# EasyEDA Pro project shankPCB.epro

# Schematic Schematic1
Board Name: Board1; Create Date: 2026-04-15; Page Name: P1; Project Name: Shank_IMU; Schematic Name: Schematic1; Update Date: 2026-04-15; Company: 嘉立创EDA; Page Size: A4; Version: V1.0
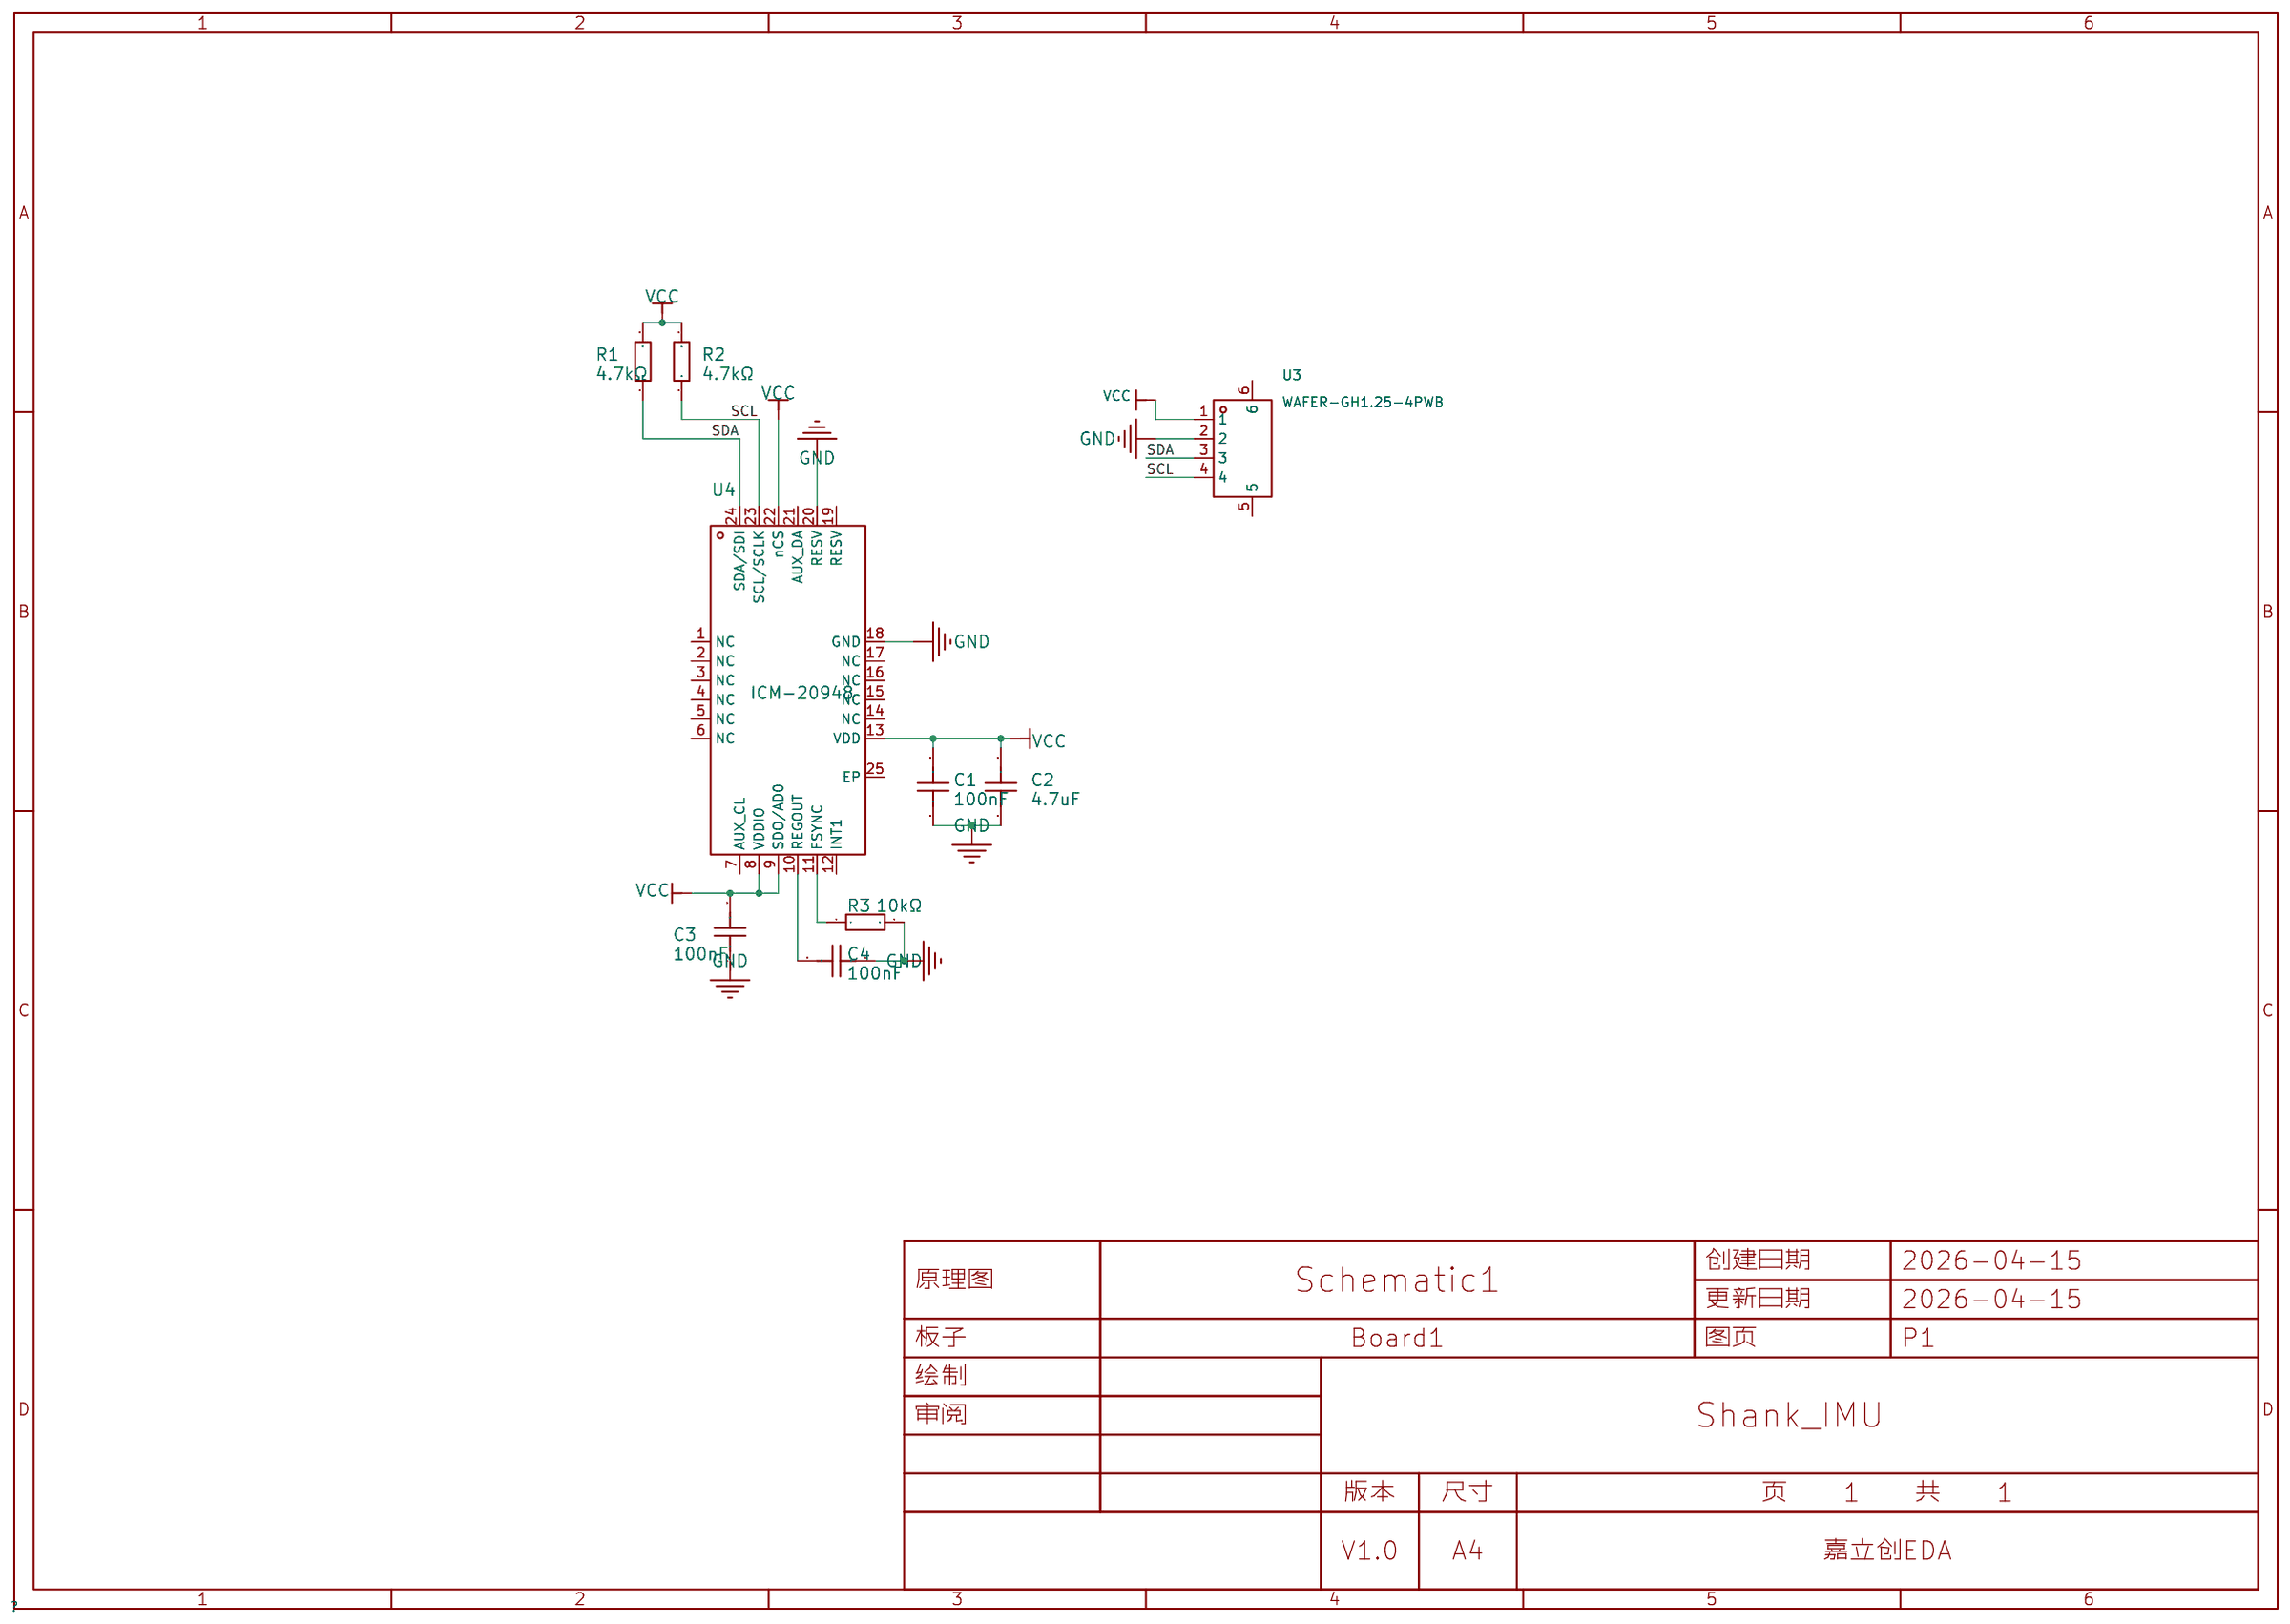
[diagram p0: schematic sheet]

## Parts
C1  100nF  [C0402]
C2  4.7uF  [C0402]
C3  100nF  [C0402]
C4  100nF  [C0402]
R1  4.7kΩ  [R0402]
R2  4.7kΩ  [R0402]
R3  10kΩ  [R0402]
U3  WAFER-GH1.25-4PWB  [CONN-SMD_4P-P1.25_XUNPU_WAFER-GH1.25-4PWB]
U4  ICM-20948  [QFN-24_L3.0-W3.0-P0.40-BL-EP]

## Library data of the parts
C1 C3 C4 = CL05B104KO5NNNC: 容值:100nF;精度:±10%;额定电压:16V;温度系数:X7R;; LCSC Part Name: 100nF ±10% 16V; Supplier Part: C1525; Manufacturer: SAMSUNG(三星); Supplier Footprint: 0402; JLCPCB Part Class: Basic Part; Datasheet: https://item.szlcsc.com/datasheet/CL05B104KO5NNNC/1877.html; Supplier: LCSC; Tolerance: ±10%; Voltage Rating: 16V; Temperature Coefficient: X7R
C2 = CL05A475MP5NRNC: 容值:4.7uF;精度:±20%;额定电压:10V;温度系数:X5R;; LCSC Part Name: 4.7uF ±20% 10V; Supplier Part: C23733; Manufacturer: SAMSUNG(三星); Supplier Footprint: 0402; JLCPCB Part Class: Basic Part; Datasheet: https://item.szlcsc.com/datasheet/CL05A475MP5NRNC/24469.html; Supplier: LCSC; Tolerance: ±20%; Voltage Rating: 10V; Temperature Coefficient: X5R
R1 R2 = 0402WGF4701TCE: 电阻类型:厚膜电阻;阻值:4.7kΩ;精度:±1%;功率:62.5mW;工作电压:50V;温度系数:±100ppm/℃;; LCSC Part Name: 4.7kΩ ±1% 62.5mW 厚膜电阻; Supplier Part: C25900; Manufacturer: UNI-ROYAL(厚声); Supplier Footprint: 0402; JLCPCB Part Class: Basic Part; Datasheet: https://item.szlcsc.com/datasheet/0402WGF4701TCE/26643.html; Supplier: LCSC; Type: 厚膜电阻; Tolerance: ±1%; Power(Watts): 62.5mW; Voltage-Supply(Max): 50V; Temperature Coefficient: ±100ppm/℃; Operating Temperature: -55℃~+155℃
R3 = FRC0402F1002TS: 电阻类型:厚膜电阻;阻值:10kΩ;精度:±1%;功率:62.5mW;工作电压:50V;温度系数:±100ppm/℃;; LCSC Part Name: 10kΩ ±1% 62.5mW 厚膜电阻; Supplier Part: C2906861; Manufacturer: FOJAN(富捷); Supplier Footprint: 0402; JLCPCB Part Class: Extended Part; Supplier: LCSC; Type: 厚膜电阻; Tolerance: ±1%; Power(Watts): 62.5mW; Voltage-Supply(Max): 50V; Temperature Coefficient: ±100ppm/℃; Operating Temperature: -55℃~+155℃
U3 = WAFER-GH1.25-4PWB: 插针结构:1x4P;间距:1.25mm;安装方式:卧贴;参考系列:GH;总PIN数:4P;排数:1;每排PIN数:4;行距:-;额定电流:1A;触头材质:黄铜;触头镀层:锡;工作温度:-25℃~+85℃;; LCSC Part Name: 1x4P 间距:1.25mm 卧贴 系列:GH; Supplier Part: C3029379; Manufacturer: XUNPU(讯普); Supplier Footprint: SMD,P=1.25mm,卧贴; JLCPCB Part Class: 扩展库; Datasheet: https://item.szlcsc.com/datasheet/WAFER-GH1.25-4PWB/3561391.html; Supplier: LCSC; Pins Structure: 1x4P; Pitch: 1.25mm; Mounting Type: 卧贴; Reference Series: GH; Number of Pins: 4P; Number of Rows: 1; Number of PINs Per Row: 4; Current Rating: 1A; Contact Material: 黄铜; Contact Plating: 锡; Operating Temperature: -25℃~+85℃; Voltage Rating: 125V; Plastic Material: LCP; Supplementary Features: 辅助焊脚; Color: 米色; Z-Height of the Board: 4.35mm; X-Length of Bottom Edge on Board (Spacing Line): 8.25mm; Y-Width of Bottom Edge on Board: 5mm
U4 = ICM-20948: LCSC Part Name: 九轴MEMS运动追踪器件; Supplier Part: C726001; Manufacturer: TDK InvenSense(应美盛); Supplier Footprint: QFN-24(3x3); JLCPCB Part Class: 扩展库; Datasheet: https://item.szlcsc.com/datasheet/ICM-20948/772651.html; Supplier: LCSC; Accelerometer Sensing Axis: X,Y,Z; Acceleration Measurement Range (MAX): ±16g; Gyroscope Sensing Axis: X,Y,Z; Gyroscope Measurement Range (MAX): ±2000dps; Sensor Type: 加速度计陀螺仪; Output Bits: 16bit; Interface: I2C；SPI; Voltage - Supply: 1.71V~3.6V; Cache Size: 0.5KB; Standby Current: 8uA; Operating Temperature: -40℃~+85℃

## Nets
GND: C1.1 C2.1 C3.1 C4.1 R3.2 U3.2 U4.18(GND) U4.20(RESV)
VCC: C1.2 C2.2 C3.2 R1.2 R2.1 U3.1 U4.8(VDDIO) U4.9(SDO/AD0) U4.13(VDD) U4.22(nCS)
SCL: R2.2 U3.4 U4.23(SCL/SCLK)
SDA: R1.1 U3.3 U4.24(SDA/SDI)
$1N627: C4.2 U4.10(REGOUT)
$1N631: R3.1 U4.11(FSYNC)

Not connected (* = marked no-connect by the designer): U3 5 6; U4 1(NC) 2(NC) 3(NC) 4(NC) 5(NC) 6(NC) 7(AUX_CL) 12(INT1) 14(NC) 15(NC) 16(NC) 17(NC) 19(RESV) 21(AUX_DA) 25(EP)

# Board PCB1
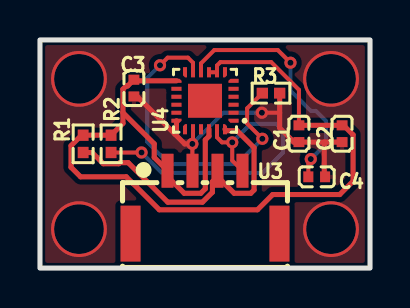
[diagram p1: board, top side]
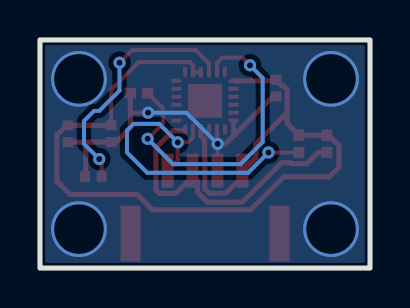
[diagram p2: board, bottom side, seen from below]

Outline 16.51 x 11.43 mm; copper layers: Top Layer, Bottom Layer. Coordinates in mm from the lower left corner of the outline.
Outline path: rectangle 0,11.43 16.51,0
Stack: Top Layer 0.035mm / Dielectric1 1.51mm FR4 er 4.5 / Bottom Layer 0.035mm

## Design rules (mm)
spacing copperThickness1oz (default): track to track 0.102, other pairs 0.152 to 0.3
spacing copperThickness2oz: track to track 0.203, other pairs 0.152 to 0.3
spacing Plane_innerPlane: track to track 0.102, other pairs 0.152 to 0.3
spacing Copper_copperRegion: track to track 0.102, other pairs 0.152 to 0.3
track width copperThickness1oz (default): min 0.127, default 0.254, max 2.54
track width copperThickness2oz: min 0.203, default 0.254, max 2.54
differential pair differentialPair (default): width min 0.127, default 0.254, max 2.54; gap min 0.152, default 0.152
pour e130 uses Copper_copperRegion
pour e146 uses Copper_copperRegion

## Placement (name value [footprint] x y rotation side)
C1  100nF  [C0402]  12.95 6.73 90 top
C2  4.7uF  [C0402]  15.11 6.73 90 top
C3  100nF  [C0402]  4.7 9.02 90 top
C4  100nF  [C0402]  13.84 4.57 180 top
R1  4.7kΩ  [R0402]  2.16 6.22 90 top
R2  4.7kΩ  [R0402]  3.56 6.22 270 top
R3  10kΩ  [R0402]  11.56 8.76 0 top
U3  WAFER-GH1.25-4PWB  [CONN-SMD_4P-P1.25_XUNPU_WAFER-GH1.25-4PWB]  8.25 3.3 0 top
U4  ICM-20948  [QFN-24_L3.0-W3.0-P0.40-BL-EP]  8.25 8.38 90 top

## Footprints (pads in the part's own frame, mm; a bottom-side part is the same pattern mirrored in y, then rotated)
C0402
  rect 0.5x0.54 smd: 1(-0.42,0) 2(0.42,0)
CONN-SMD_4P-P1.25_XUNPU_WAFER-GH1.25-4PWB
  rect 0.6x1.7 smd: 1(-1.875,1.575) 2(-0.625,1.575) 3(0.625,1.575) 4(1.875,1.575)
  rect 1x2.8 smd: 5(3.725,-1.575) 6(-3.725,-1.575)
QFN-24_L3.0-W3.0-P0.40-BL-EP
  custom 0.2x0.506 smd: 1(-1,-1.427) 6(1,-1.427) 13(1,1.427) 18(-1,1.427)
  rect 0.2x0.505 smd: 2(-0.6,-1.427) 3(-0.2,-1.427) 4(0.2,-1.427) 5(0.6,-1.427) 14(0.6,1.427) 15(0.2,1.427) 16(-0.2,1.427) 17(-0.6,1.427)
  custom 0.506x0.2 smd: 7(1.427,-1) 12(1.427,1) 19(-1.427,1) 24(-1.427,-1)
  rect 0.505x0.2 smd: 8(1.427,-0.6) 9(1.427,-0.2) 10(1.427,0.2) 11(1.427,0.6) 20(-1.427,0.6) 21(-1.427,0.2) 22(-1.427,-0.2) 23(-1.427,-0.6)
  rect 1.7x1.7 smd: 25(0,0)
R0402
  rect 0.566x0.54 smd: 1(-0.433,0) 2(0.433,0)

## Nets
As in the schematic.

Pads without a net: U3 5 6; U4 1 2 3 4 5 6 7 12 14 15 16 17 19 21 25

## Via types
v1: diameter 0.61, hole 0.305, Top Layer to Bottom Layer, 8 vias
v2: diameter 2.794, hole 2.489, Top Layer to Bottom Layer, 4 vias

## Routing (per net, layer and track width the routed paths; a pad name or vN(x,y) marks a point on that pad's centre or on a via; arc(x,y) is an arc through that point)
GND: length 18.8
  Top Layer w0.2: U3.2 7.47,5.03 7.62,5.19 v1(7.62,6.22) 7.66,6.25 U4.20 ; 11.99,7.78 v1(11.1,7.78)
  Top Layer w0.254: C3.1 4.86,8.6 6.75,6.71 ; 14.22,6.31 14.22,4.61 C4.1 ; 14.22,6.31 C1.1 12.7,6.31 11.99,7.02 11.99,8.76 ; 14.22,6.31 C2.1 ; v1(7.62,6.22) 7.24,6.22 6.75,6.71 ; 6.75,6.71 6.83,6.78 U4.18
  Bottom Layer w0.2: v1(11.1,7.78) 9.19,7.78 v1(7.62,6.22)
  vias: v2(1.95,9.48) v2(1.95,1.95) v2(14.56,9.48) v2(14.56,1.95)
VCC: length 46.3
  Top Layer w0.2: U4.9 U4.8 8.85,10.15 9.03,10.32 11.57,10.32 12.95,8.93 C1.2
  Top Layer w0.254: U4.22 8.45,6.61 8.27,6.42 8.27,3.97 8.05,3.75 7.21,3.75 6.38,4.58 U3.1 5.72,5.54 5.72,6.22 4.15,7.79 ; 4.15,7.79 4.15,8.96 4.31,9.13 4.39,9.13 C3.2 4.75,9.38 U4.13 ; 4.15,7.79 4.15,7.25 R2.1 R1.2 2.08,6.66 1.55,6.13 1.55,5.05 2.03,4.57 4.32,4.57 5.97,2.92 10.88,2.92 11.64,3.68 14.99,3.68 15.66,4.35 15.66,6.68 15.19,7.15 C2.2 C1.2
SCL: length 16.5
  Top Layer w0.2: U3.4 9.62,5.39 v1(9.62,6.3) 9.11,6.3 8.85,6.55 U4.23 ; 3.56,5.79 v1(5.08,5.79)
  Bottom Layer w0.2: v1(9.62,6.3) 10.54,7.23 11.82,7.23 12.16,6.89 12.16,5.79 11.14,4.77 6.1,4.77 v1(5.08,5.79)
SDA: length 15.1
  Top Layer w0.254: U3.3 8.88,4.58 ; 8.88,4.58 8.63,4.33 8.63,3.8 8.13,3.3 6.39,3.3 4.41,5.28 4,5.28 3.94,5.23 3.17,5.23 2.61,5.79 2.16,5.79 ; 8.88,4.58 9.71,3.75 10.55,3.75 10.71,3.91 10.71,6.03 9.86,6.88 9.33,6.88 U4.24
$1N627: length 12.4
  Top Layer w0.2: U4.10 8.06,10.26 8.72,10.92 11.9,10.92 v1(12.53,10.29) ; v1(13.55,5.46) 13.42,5.34 C4.2
  Bottom Layer w0.2: v1(13.55,5.46) 14.31,6.22 14.31,7.37 13.8,7.87 13.55,7.87 12.53,8.89 v1(12.53,10.29)
$1N631: length 16.2
  Top Layer w0.2: R3.1 10.36,8 10.36,7.24 v1(11.12,6.48) ; v1(6,10.16) 6.38,10.54 7.4,10.54 7.66,10.29 U4.11
  Bottom Layer w0.2: v1(6,10.16) 5.37,9.53 5.37,6.31 6.48,5.21 9.85,5.21 v1(11.12,6.48)

## Copper pours and planes (outline as drawn; the poured copper is in the pictures)
GND on Top Layer: -0.63,12.06 17.14,12.06 17.14,-0.63 -0.63,-0.63
GND on Bottom Layer: -0.63,12.06 17.14,12.06 17.14,-0.63 -0.63,-0.63
